# Altium schematic sheet Pico+Battery.SchDoc
size A; SheetNumber: 2; SheetTotal: 7
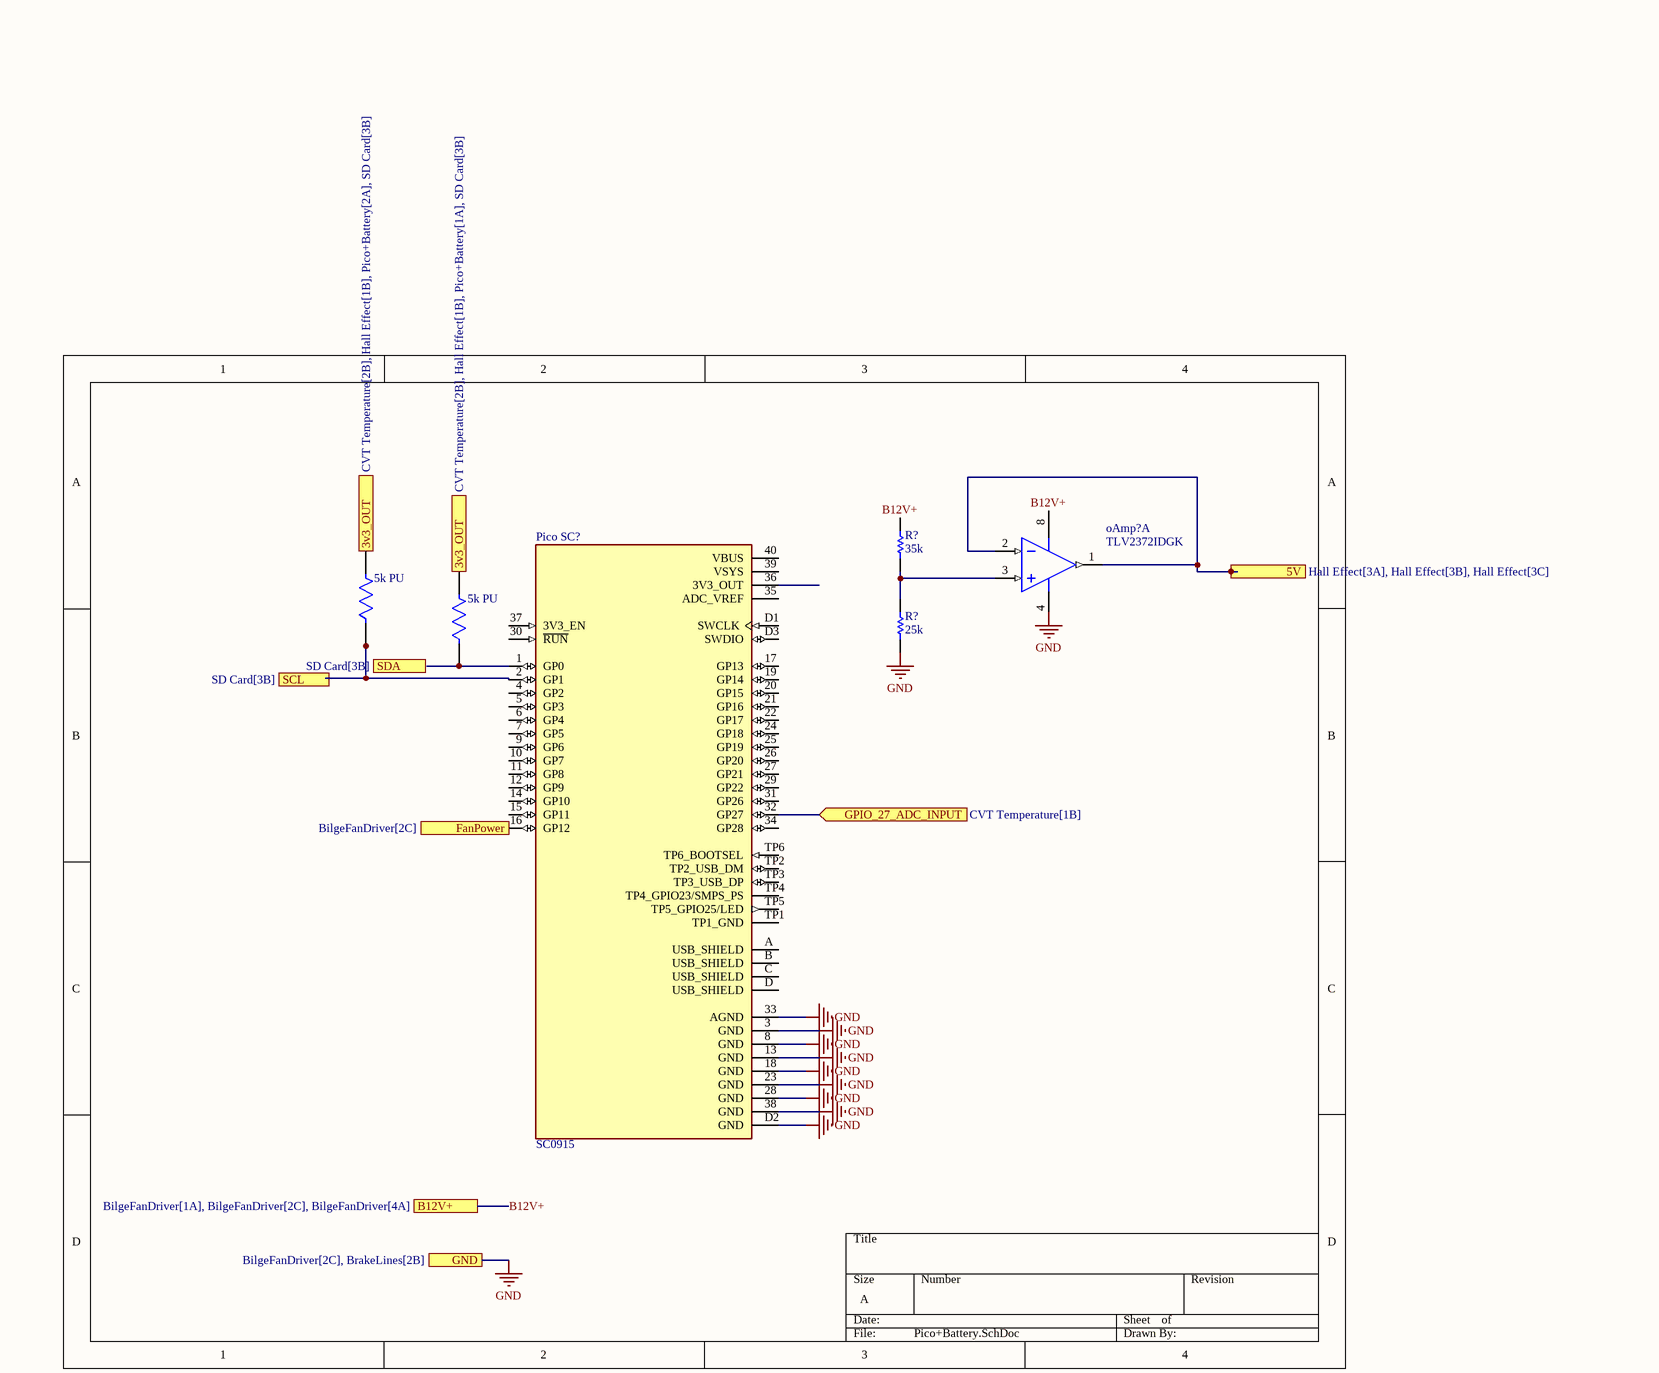
[diagram p0: Pico+Battery.SchDoc]

## Parts
(Parts that share a designator on the sheet are numbered #1, #2 ... from top to bottom, then left to right.)
5k_PU#1  PLT0805Z5001AST5  [FP-PLT0805-MFG]  (value not drawn)
5k_PU#2  PLT0805Z5001AST5  [FP-PLT0805-MFG]  (value not drawn)
oAmp?  TLV2372IDGK  [DGK0008A_N]  (part A of 2)
Pico_SC?  SC0915  [MODULE_SC0915]
R?#1  value 35k  (hidden comment: Resistor)
R?#2  value 25k  (hidden comment: Resistor)

## Ports
3v3_OUT (in, see CVT Temperature[2B], Hall Effect[1B], Pico+Battery[1A], SD Card[3B]), 3v3_OUT (in, see CVT Temperature[2B], Hall Effect[1B], Pico+Battery[2A], SD Card[3B]), 5V (out, see Hall Effect[3A], Hall Effect[3B], Hall Effect[3C]), B12V+ (see BilgeFanDriver[1A], BilgeFanDriver[2C], BilgeFanDriver[4A]), FanPower (see BilgeFanDriver[2C]), GND (see BilgeFanDriver[2C], BrakeLines[2B]), GPIO_27_ADC_INPUT (in, see CVT Temperature[1B]), SCL (see SD Card[3B]), SDA (see SD Card[3B])

## Nets
GND: Pico_SC?.3(GND) Pico_SC?.8(GND) Pico_SC?.13(GND) Pico_SC?.18(GND) Pico_SC?.23(GND) Pico_SC?.28(GND) Pico_SC?.33(AGND) Pico_SC?.38(GND) Pico_SC?.D2(GND) R?#2.2 ; port GND
3v3_OUT: 5k_PU#1.2 5k_PU#2.2 ; port 3v3_OUT
5V: oAmp?.1(OUT1) oAmp?.2(IN1-) ; port 5V
B12V+: oAmp?.8(VDD) R?#1.1 ; port B12V+
FanPower: Pico_SC?.16(GP12) ; port FanPower
GPIO_27_ADC_INPUT: Pico_SC?.32(GP27) ; port GPIO_27_ADC_INPUT
Net5k_PU#1_1: 5k_PU#1.1 Pico_SC?.2(GP1)
Net5k_PU#2_1: 5k_PU#2.1 Pico_SC?.1(GP0)
NetoAmp?_3: oAmp?.3(IN1+) R?#1.2 R?#2.1

Not connected (* = marked no-connect by the designer): oAmp? 4(GND); Pico_SC? 4(GP2) 5(GP3) 6(GP4) 7(GP5) 9(GP6) 10(GP7) 11(GP8) 12(GP9) 14(GP10) 15(GP11) 17(GP13) 19(GP14) 20(GP15) 21(GP16) 22(GP17) 24(GP18) 25(GP19) 26(GP20) 27(GP21) 29(GP22) 30(~{RUN}) 31(GP26) 34(GP28) 35(ADC_VREF) 36(3V3_OUT) 37(3V3_EN) 39(VSYS) 40(VBUS) A(USB_SHIELD) B(USB_SHIELD) C(USB_SHIELD) D(USB_SHIELD) D1(SWCLK) D3(SWDIO) TP1(TP1_GND) TP2(TP2_USB_DM) TP3(TP3_USB_DP) TP4(TP4_GPIO23/SMPS_PS) TP5(TP5_GPIO25/LED) TP6(TP6_BOOTSEL)

## Notes on the sheet
- Labels drawn without touching a wire or pin: GND

## Library data of the parts
5k_PU#1 5k_PU#2 = CMP-00030-44317389-1: PLT0805Z5001AST5 SMD Chip Resistor, 5 kOhm, ± 0.05%, 250 mW, 0805 [2012 Metric], Thin Film, Precision; Temperature Coefficient: 5ppm/°C; Resistance: 5kΩ; Voltage Rating: 100V; Power Rating: 250mW; Depth: 1.27mm; Length: 2.032mm; Case Code (Imperial): 0805; RoHS: Compliant; Case Code (Metric): 2012; Features: Moisture Resistant; Max Operating Temperature: 125°C; Min Operating Temperature: -55°C; Tolerance: 0.05%; NexarPartId: 44317389; Width: 1.27mm; Voltage Rating (DC): 100V; Max Power Dissipation: 250mW; Case/Package: 0805; Number of Terminations: 2; Composition: Thin Film; Schedule B: 8533210045; Military Standard: Not; Height: 838.2µm
oAmp? = CMP-0272-03409-3: 550 uA/Ch, 3 MHz, RRIO Operational Amplifier, 2.7 to 16 V, -40 to 125 degC, 8-pin SOP (DGK8), Green (RoHS & no Sb/Br); Manufacturer: Texas Instruments; Number of Channels: 2; Packing: TUBE; Slew Rate(Typ)(V/us): 2.4; Total Supply Voltage(Min)(+5V is 5, +/-5V is 10): 2.7; Sub Family: Low Supply Voltage Amplifier (<=2.7V), Precision Amplifier; GBW(Typ)(MHz): 3; IIB(Max)(pA): 60; CMRR(Min)(dB): 50; Rating: Catalog; Vio (25C)(Max)(mV): 4.5; Iq per channel(Max)(mA): 0.9; Total Supply Voltage(Max)(+5V is 5, +/-5V is 10): 16; PartNumber: TLV2372IDGK; ComponentLink2URL: http://www.ti.com/lit/ds/symlink/tlv2372.pdf; ComponentLink1URL: http://www.ti.com/; PackageVersion: 4073329/E, 05/2006; Code_JEDEC: MO-187; Offset Drift(Typ)(uV/C): 2; Mounting Technology: Surface Mount; ComponentLink3Description: Package Specification; Eco-Plan: Green (RoHS & no Sb/Br); ComponentLink3URL: http://www.ti.com/litv/pdf/mpds028d; PackageDescription: 8-Pin Thin Small Outline, Body 3 x 3 mm, Pitch 0.65 mm; ComponentLink1Description: Manufacturer URL; PackageReference: DGK0008A; ComponentLink2Description: Datasheet; DatasheetVersion: SLOS270D
Pico_SC? = SC0915: RP2040 Raspberry Pi Pico series ARMÂ® CortexÂ®-M0+ MCU 32-Bit Embedded Evaluation Board; SnapEDA_Link: https://www.snapeda.com/parts/SC0915/Raspberry+Pi/view-part/?ref=snap; Availability: In Stock; Package: None; Price: None; MP: SC0915; Check_prices: https://www.snapeda.com/parts/SC0915/Raspberry+Pi/view-part/?ref=eda; MF: Raspberry Pi; Value: *; Purchase-URL: https://pricing.snapeda.com/search/part/SC0915/?ref=eda
R?#1 R?#2 = Resistor: TC1: 0; SimulationGenericComponent: True; TC2: 0